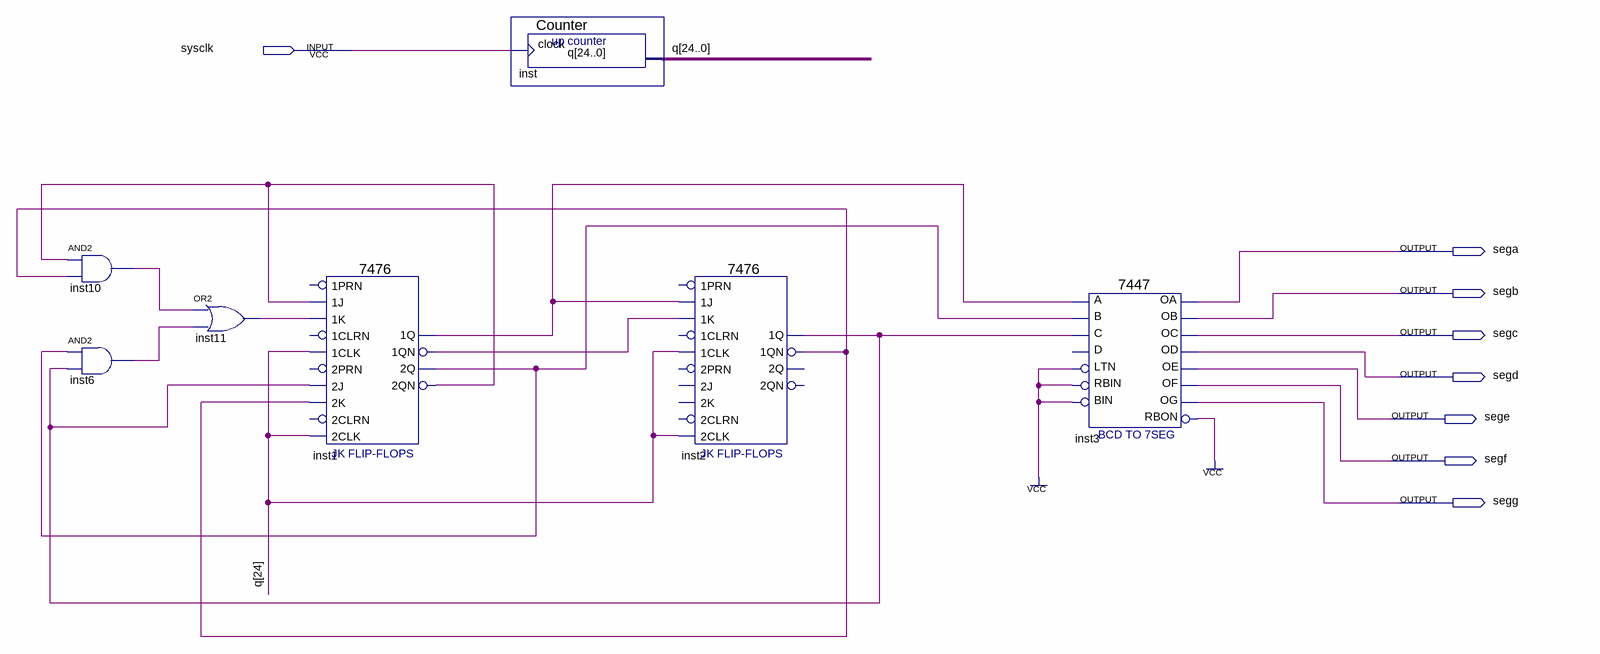
[diagram p0: schematic sheet]
// Quartus schematic Random_Synchronous_Counter.bdf as structural Verilog: 7 symbols, 8 pins
module Random_Synchronous_Counter (
  input  sysclk,
  output sega,
  output segb,
  output segc,
  output segd,
  output sege,
  output segf,
  output segg
);

  wire inst1_1q, inst1_1qn, inst1_2q, inst1_2qn, inst2_1q, inst2_1qn, inst3_rbon, inst6_out, inst10_out,
       inst11_out;
  wire [24:0] q;

  and inst10 (inst10_out, inst1_2qn, inst2_1qn);
  and inst6 (inst6_out, inst1_2q, inst2_1q);
  or inst11 (inst11_out, inst10_out, inst6_out);
  \7476  inst1 (
    .\1J (inst1_2qn), .\1K (inst11_out), .\2J (inst2_1q), .\1CLK (q[24]), .\2K (inst2_1qn), .\2CLK (q[24]),
    .\2QN (inst1_2qn), .\1Q (inst1_1q), .\2Q (inst1_2q), .\1QN (inst1_1qn));  // open: 1PRN, 2PRN, 1CLRN, 2CLRN
  Counter inst (.clock(sysclk), .q(q));
  \7476  inst2 (
    .\1J (inst1_1q), .\1K (inst1_1qn), .\1CLK (q[24]), .\2CLK (q[24]), .\1Q (inst2_1q), .\1QN (inst2_1qn));  // open: 1PRN, 2PRN, 2J, 1CLRN, 2K, 2CLRN, 2QN, 2Q
  \7447  inst3 (
    .LTN(1'b1), .B(inst1_2q), .C(inst2_1q), .RBIN(1'b1), .BIN(1'b1), .A(inst1_1q), .OB(segb), .OC(segc),
    .OE(sege), .OD(segd), .OF(segf), .OG(segg), .OA(sega), .RBON(inst3_rbon));  // open: D
  // also tied to VCC on the sheet: inst3_rbon
endmodule
